# Vivado block design pfm_dynamic, xcu200-fsgd2104-2-e, Vivado 2020.2
# (continued, part 2 of 3)
current_bd_instance /slr0

# ---- hierarchy /slr0/reset_controllers ----
current_bd_instance /slr0/reset_controllers
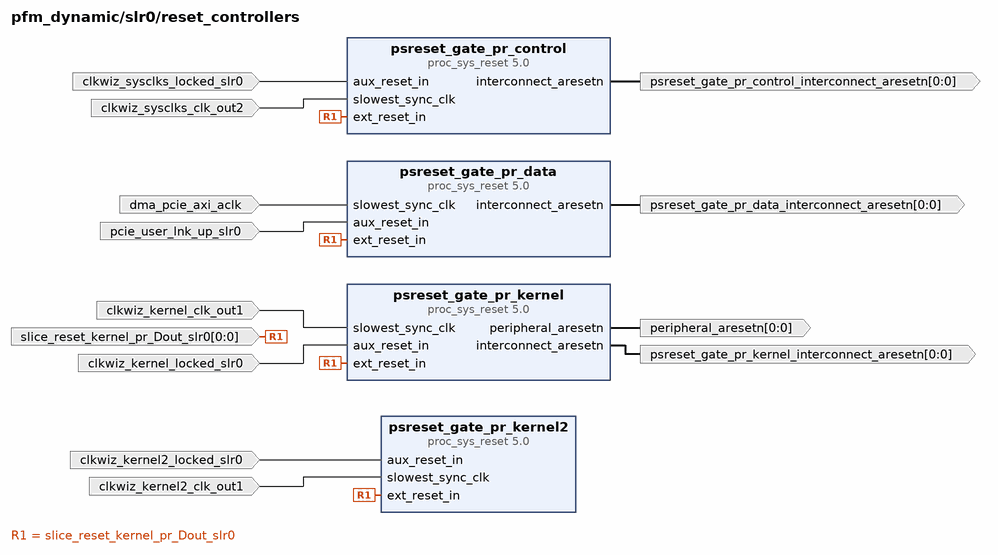
[diagram p9: block diagram inside /slr0/reset_controllers]
create_bd_pin -dir I -type clk clkwiz_kernel2_clk_out1
create_bd_pin -dir I clkwiz_kernel2_locked_slr0
create_bd_pin -dir I -type clk clkwiz_kernel_clk_out1
create_bd_pin -dir I clkwiz_kernel_locked_slr0
create_bd_pin -dir I -type clk clkwiz_sysclks_clk_out2
create_bd_pin -dir I clkwiz_sysclks_locked_slr0
create_bd_pin -dir I -type clk dma_pcie_axi_aclk
create_bd_pin -dir I pcie_user_lnk_up_slr0
create_bd_pin -dir O -from 0 -to 0 -type rst psreset_gate_pr_control_interconnect_aresetn
create_bd_pin -dir O -from 0 -to 0 -type rst psreset_gate_pr_data_interconnect_aresetn
create_bd_pin -dir O -from 0 -to 0 -type rst psreset_gate_pr_kernel_interconnect_aresetn
create_bd_pin -dir I -from 0 -to 0 -type rst slice_reset_kernel_pr_Dout_slr0
create_bd_pin -dir O -from 0 -to 0 -type rst peripheral_aresetn

create_bd_cell -type ip -vlnv xilinx.com:ip:proc_sys_reset:5.0 psreset_gate_pr_control
set_property -dict [list \
  CONFIG.C_AUX_RESET_HIGH 0 \
  CONFIG.C_AUX_RST_WIDTH 1 \
  CONFIG.C_EXT_RST_WIDTH 1 \
] [get_bd_cells psreset_gate_pr_control]
create_bd_cell -type ip -vlnv xilinx.com:ip:proc_sys_reset:5.0 psreset_gate_pr_data
set_property -dict [list \
  CONFIG.C_AUX_RESET_HIGH 0 \
  CONFIG.C_AUX_RST_WIDTH 1 \
  CONFIG.C_EXT_RST_WIDTH 1 \
] [get_bd_cells psreset_gate_pr_data]
create_bd_cell -type ip -vlnv xilinx.com:ip:proc_sys_reset:5.0 psreset_gate_pr_kernel
set_property -dict [list \
  CONFIG.C_AUX_RESET_HIGH 0 \
  CONFIG.C_AUX_RST_WIDTH 1 \
  CONFIG.C_EXT_RST_WIDTH 1 \
  CONFIG.SLR_ASSIGNMENTS SLR0 \
] [get_bd_cells psreset_gate_pr_kernel]
create_bd_cell -type ip -vlnv xilinx.com:ip:proc_sys_reset:5.0 psreset_gate_pr_kernel2
set_property -dict [list \
  CONFIG.C_AUX_RESET_HIGH 0 \
  CONFIG.C_AUX_RST_WIDTH 1 \
  CONFIG.C_EXT_RST_WIDTH 1 \
  CONFIG.SLR_ASSIGNMENTS SLR0 \
] [get_bd_cells psreset_gate_pr_kernel2]

# ---- hierarchy /slr1 ----
current_bd_instance /slr1
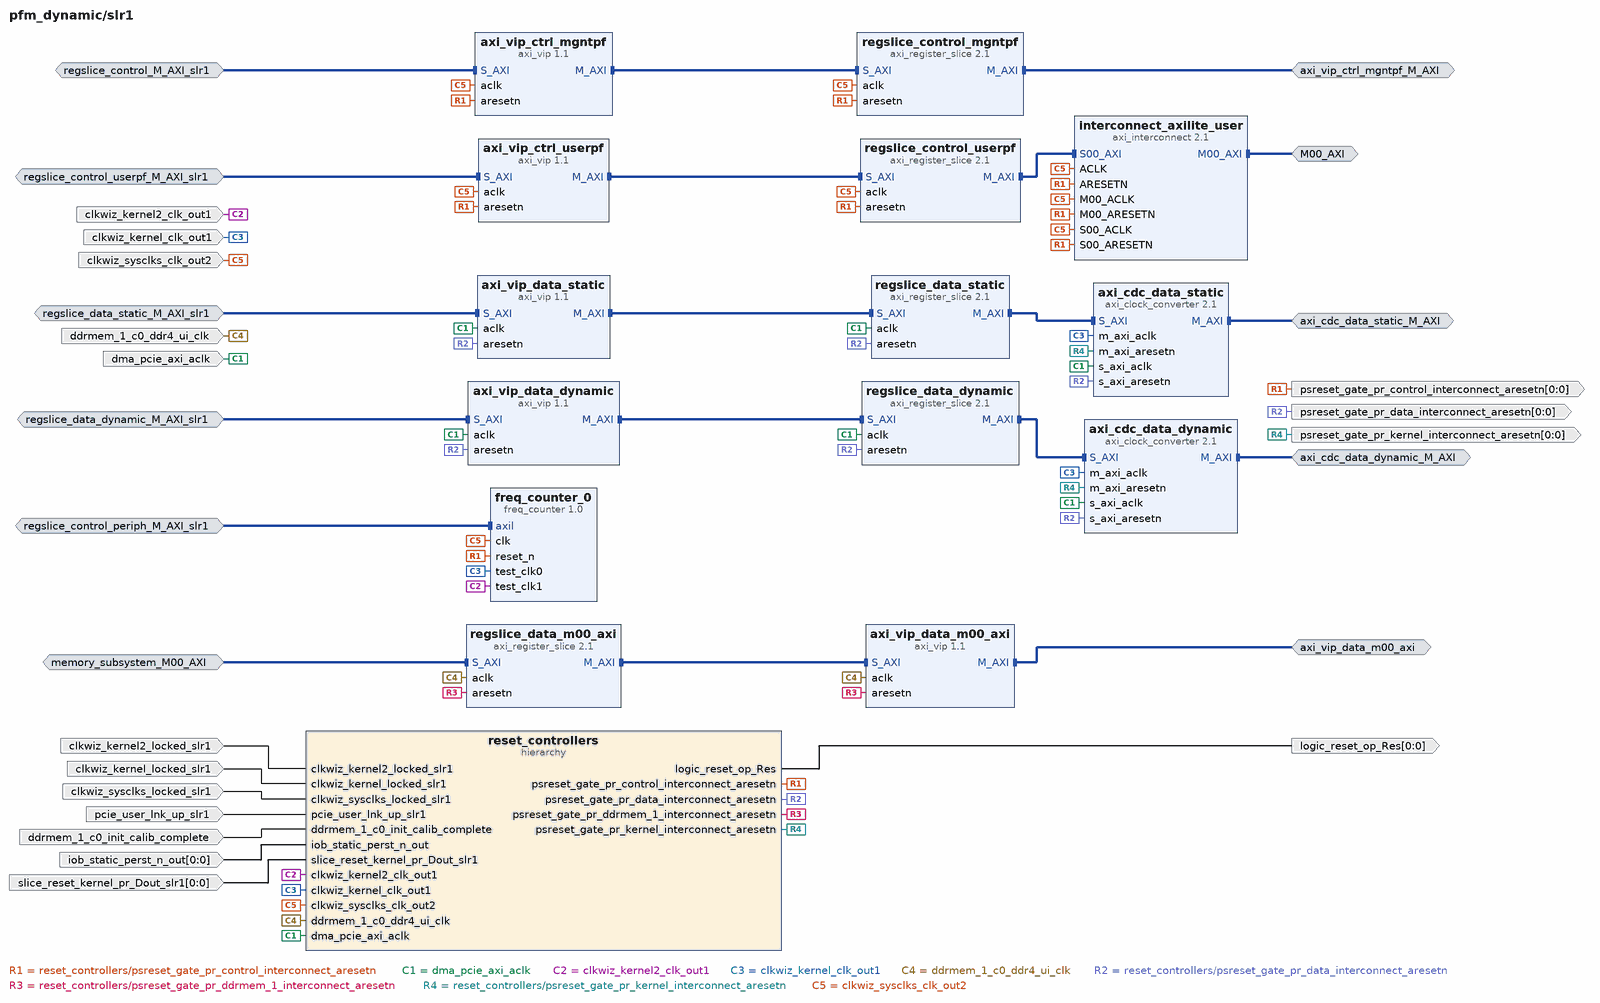
[diagram p10: block diagram inside /slr1]
create_bd_intf_pin -mode Master -vlnv xilinx.com:interface:aximm_rtl:1.0 axi_cdc_data_dynamic_M_AXI
create_bd_intf_pin -mode Master -vlnv xilinx.com:interface:aximm_rtl:1.0 axi_cdc_data_static_M_AXI
create_bd_intf_pin -mode Master -vlnv xilinx.com:interface:aximm_rtl:1.0 axi_vip_ctrl_mgntpf_M_AXI
create_bd_intf_pin -mode Master -vlnv xilinx.com:interface:aximm_rtl:1.0 axi_vip_data_m00_axi
create_bd_intf_pin -mode Slave -vlnv xilinx.com:interface:aximm_rtl:1.0 memory_subsystem_M00_AXI
create_bd_intf_pin -mode Slave -vlnv xilinx.com:interface:aximm_rtl:1.0 regslice_control_M_AXI_slr1
create_bd_intf_pin -mode Slave -vlnv xilinx.com:interface:aximm_rtl:1.0 regslice_control_periph_M_AXI_slr1
create_bd_intf_pin -mode Slave -vlnv xilinx.com:interface:aximm_rtl:1.0 regslice_control_userpf_M_AXI_slr1
create_bd_intf_pin -mode Slave -vlnv xilinx.com:interface:aximm_rtl:1.0 regslice_data_dynamic_M_AXI_slr1
create_bd_intf_pin -mode Slave -vlnv xilinx.com:interface:aximm_rtl:1.0 regslice_data_static_M_AXI_slr1
create_bd_intf_pin -mode Master -vlnv xilinx.com:interface:aximm_rtl:1.0 M00_AXI
create_bd_pin -dir I -type clk clkwiz_kernel2_clk_out1
create_bd_pin -dir I clkwiz_kernel2_locked_slr1
create_bd_pin -dir I -type clk clkwiz_kernel_clk_out1
create_bd_pin -dir I clkwiz_kernel_locked_slr1
create_bd_pin -dir I -type clk clkwiz_sysclks_clk_out2
create_bd_pin -dir I clkwiz_sysclks_locked_slr1
create_bd_pin -dir I -type clk ddrmem_1_c0_ddr4_ui_clk
create_bd_pin -dir I ddrmem_1_c0_init_calib_complete
create_bd_pin -dir I -type clk dma_pcie_axi_aclk
create_bd_pin -dir I -from 0 -to 0 iob_static_perst_n_out
create_bd_pin -dir O -from 0 -to 0 logic_reset_op_Res
create_bd_pin -dir I pcie_user_lnk_up_slr1
create_bd_pin -dir O -from 0 -to 0 -type rst psreset_gate_pr_data_interconnect_aresetn
create_bd_pin -dir O -from 0 -to 0 -type rst psreset_gate_pr_kernel_interconnect_aresetn
create_bd_pin -dir I -from 0 -to 0 -type rst slice_reset_kernel_pr_Dout_slr1
create_bd_pin -dir O -from 0 -to 0 -type rst psreset_gate_pr_control_interconnect_aresetn

create_bd_cell -type ip -vlnv xilinx.com:user:freq_counter:1.0 freq_counter_0
set_property -dict {CONFIG.REF_CLK_FREQ_HZ 50925} [get_bd_cells freq_counter_0]
create_bd_cell -type hier reset_controllers
create_bd_cell -type ip -vlnv xilinx.com:ip:axi_interconnect:2.1 interconnect_axilite_user
set_property -dict [list \
  CONFIG.M00_HAS_REGSLICE 4 \
  CONFIG.M01_HAS_REGSLICE 4 \
  CONFIG.M02_HAS_REGSLICE 4 \
  CONFIG.M03_HAS_REGSLICE 4 \
  CONFIG.M04_HAS_REGSLICE 4 \
  CONFIG.M05_HAS_REGSLICE 4 \
  CONFIG.M06_HAS_REGSLICE 4 \
  CONFIG.M07_HAS_REGSLICE 4 \
  CONFIG.M08_HAS_REGSLICE 4 \
  CONFIG.M09_HAS_REGSLICE 4 \
  CONFIG.M10_HAS_REGSLICE 4 \
  CONFIG.M11_HAS_REGSLICE 4 \
  CONFIG.M12_HAS_REGSLICE 4 \
  CONFIG.M13_HAS_REGSLICE 4 \
  CONFIG.M14_HAS_REGSLICE 4 \
  CONFIG.M15_HAS_REGSLICE 4 \
  CONFIG.M16_HAS_REGSLICE 4 \
  CONFIG.M17_HAS_REGSLICE 4 \
  CONFIG.M18_HAS_REGSLICE 4 \
  CONFIG.M19_HAS_REGSLICE 4 \
  CONFIG.M20_HAS_REGSLICE 4 \
  CONFIG.M21_HAS_REGSLICE 4 \
  CONFIG.M22_HAS_REGSLICE 4 \
  CONFIG.M23_HAS_REGSLICE 4 \
  CONFIG.M24_HAS_REGSLICE 4 \
  CONFIG.M25_HAS_REGSLICE 4 \
  CONFIG.M26_HAS_REGSLICE 4 \
  CONFIG.M27_HAS_REGSLICE 4 \
  CONFIG.M28_HAS_REGSLICE 4 \
  CONFIG.M29_HAS_REGSLICE 4 \
  CONFIG.M30_HAS_REGSLICE 4 \
  CONFIG.M31_HAS_REGSLICE 4 \
  CONFIG.M32_HAS_REGSLICE 4 \
  CONFIG.M33_HAS_REGSLICE 4 \
  CONFIG.M34_HAS_REGSLICE 4 \
  CONFIG.M35_HAS_REGSLICE 4 \
  CONFIG.M36_HAS_REGSLICE 4 \
  CONFIG.M37_HAS_REGSLICE 4 \
  CONFIG.M38_HAS_REGSLICE 4 \
  CONFIG.M39_HAS_REGSLICE 4 \
  CONFIG.M40_HAS_REGSLICE 4 \
  CONFIG.M41_HAS_REGSLICE 4 \
  CONFIG.M42_HAS_REGSLICE 4 \
  CONFIG.M43_HAS_REGSLICE 4 \
  CONFIG.M44_HAS_REGSLICE 4 \
  CONFIG.M45_HAS_REGSLICE 4 \
  CONFIG.M46_HAS_REGSLICE 4 \
  CONFIG.M47_HAS_REGSLICE 4 \
  CONFIG.M48_HAS_REGSLICE 4 \
  CONFIG.M49_HAS_REGSLICE 4 \
  CONFIG.M50_HAS_REGSLICE 4 \
  CONFIG.M51_HAS_REGSLICE 4 \
  CONFIG.M52_HAS_REGSLICE 4 \
  CONFIG.M53_HAS_REGSLICE 4 \
  CONFIG.M54_HAS_REGSLICE 4 \
  CONFIG.M55_HAS_REGSLICE 4 \
  CONFIG.M56_HAS_REGSLICE 4 \
  CONFIG.M57_HAS_REGSLICE 4 \
  CONFIG.M58_HAS_REGSLICE 4 \
  CONFIG.M59_HAS_REGSLICE 4 \
  CONFIG.M60_HAS_REGSLICE 4 \
  CONFIG.M61_HAS_REGSLICE 4 \
  CONFIG.M62_HAS_REGSLICE 4 \
  CONFIG.M63_HAS_REGSLICE 4 \
  CONFIG.NUM_MI 1 \
  CONFIG.NUM_SI 1 \
  CONFIG.S00_HAS_REGSLICE 4 \
  CONFIG.SLR_ASSIGNMENTS SLR1 \
] [get_bd_cells interconnect_axilite_user]
create_bd_cell -type ip -vlnv xilinx.com:ip:axi_clock_converter:2.1 axi_cdc_data_dynamic
set_property -dict {CONFIG.SLR_ASSIGNMENTS SLR1} [get_bd_cells axi_cdc_data_dynamic]
create_bd_cell -type ip -vlnv xilinx.com:ip:axi_clock_converter:2.1 axi_cdc_data_static
set_property -dict {CONFIG.SLR_ASSIGNMENTS SLR1} [get_bd_cells axi_cdc_data_static]
create_bd_cell -type ip -vlnv xilinx.com:ip:axi_vip:1.1 axi_vip_ctrl_mgntpf
create_bd_cell -type ip -vlnv xilinx.com:ip:axi_vip:1.1 axi_vip_ctrl_userpf
create_bd_cell -type ip -vlnv xilinx.com:ip:axi_vip:1.1 axi_vip_data_dynamic
create_bd_cell -type ip -vlnv xilinx.com:ip:axi_vip:1.1 axi_vip_data_m00_axi
create_bd_cell -type ip -vlnv xilinx.com:ip:axi_vip:1.1 axi_vip_data_static
create_bd_cell -type ip -vlnv xilinx.com:ip:axi_register_slice:2.1 regslice_control_mgntpf
set_property -dict [list \
  CONFIG.ADDR_WIDTH 26 \
  CONFIG.DATA_WIDTH 32 \
  CONFIG.PROTOCOL AXI4LITE \
  CONFIG.READ_WRITE_MODE READ_WRITE \
  CONFIG.REG_R 7 \
  CONFIG.REG_W 7 \
  CONFIG.SLR_ASSIGNMENTS SLR1 \
] [get_bd_cells regslice_control_mgntpf]
create_bd_cell -type ip -vlnv xilinx.com:ip:axi_register_slice:2.1 regslice_control_userpf
set_property -dict [list \
  CONFIG.ADDR_WIDTH 25 \
  CONFIG.DATA_WIDTH 32 \
  CONFIG.PROTOCOL AXI4LITE \
  CONFIG.READ_WRITE_MODE READ_WRITE \
  CONFIG.REG_R 7 \
  CONFIG.REG_W 7 \
  CONFIG.SLR_ASSIGNMENTS SLR1 \
] [get_bd_cells regslice_control_userpf]
create_bd_cell -type ip -vlnv xilinx.com:ip:axi_register_slice:2.1 regslice_data_dynamic
set_property -dict [list \
  CONFIG.ADDR_WIDTH 39 \
  CONFIG.DATA_WIDTH 512 \
  CONFIG.ID_WIDTH 4 \
  CONFIG.PROTOCOL AXI4 \
  CONFIG.READ_WRITE_MODE READ_WRITE \
  CONFIG.REG_AR 1 \
  CONFIG.REG_AW 1 \
  CONFIG.REG_B 1 \
  CONFIG.SLR_ASSIGNMENTS SLR1 \
] [get_bd_cells regslice_data_dynamic]
create_bd_cell -type ip -vlnv xilinx.com:ip:axi_register_slice:2.1 regslice_data_m00_axi
set_property -dict [list \
  CONFIG.REG_AR 1 \
  CONFIG.REG_AW 1 \
  CONFIG.REG_B 1 \
  CONFIG.SLR_ASSIGNMENTS SLR1 \
] [get_bd_cells regslice_data_m00_axi]
create_bd_cell -type ip -vlnv xilinx.com:ip:axi_register_slice:2.1 regslice_data_static
set_property -dict [list \
  CONFIG.ADDR_WIDTH 39 \
  CONFIG.DATA_WIDTH 512 \
  CONFIG.ID_WIDTH 4 \
  CONFIG.PROTOCOL AXI4 \
  CONFIG.READ_WRITE_MODE READ_WRITE \
  CONFIG.REG_AR 1 \
  CONFIG.REG_AW 1 \
  CONFIG.REG_B 1 \
  CONFIG.REG_W 1 \
  CONFIG.SLR_ASSIGNMENTS SLR1 \
] [get_bd_cells regslice_data_static]

# ---- hierarchy /slr1/reset_controllers ----
current_bd_instance /slr1/reset_controllers
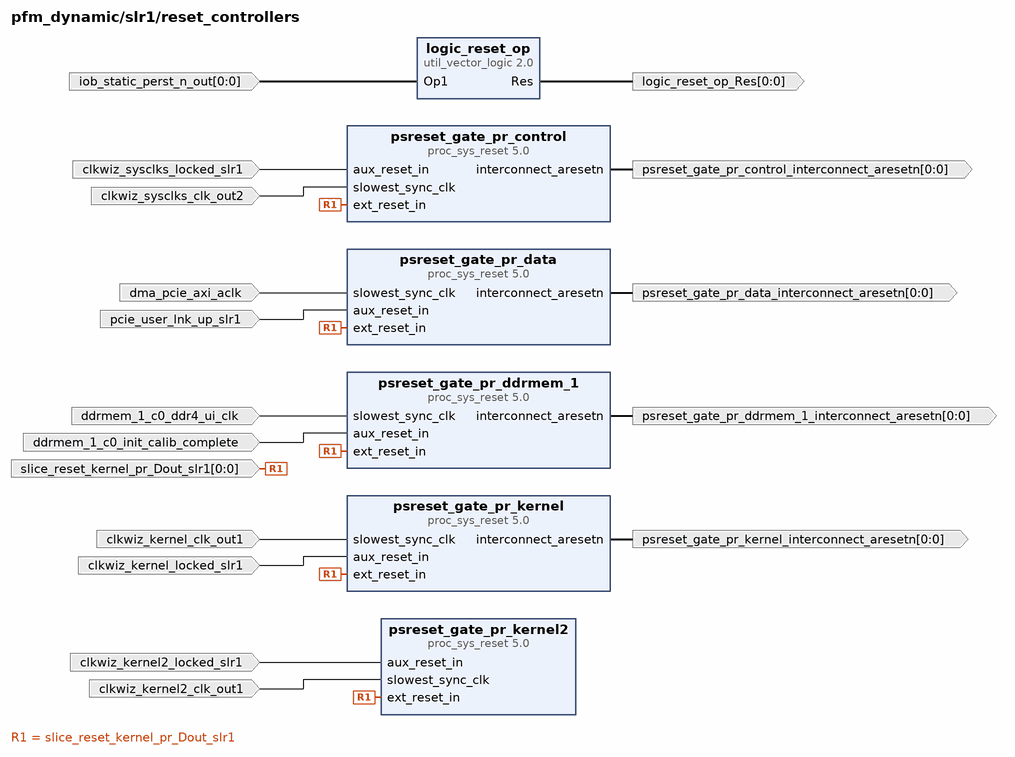
[diagram p11: block diagram inside /slr1/reset_controllers]
create_bd_pin -dir I -type clk clkwiz_kernel2_clk_out1
create_bd_pin -dir I clkwiz_kernel2_locked_slr1
create_bd_pin -dir I -type clk clkwiz_kernel_clk_out1
create_bd_pin -dir I clkwiz_kernel_locked_slr1
create_bd_pin -dir I -type clk clkwiz_sysclks_clk_out2
create_bd_pin -dir I clkwiz_sysclks_locked_slr1
create_bd_pin -dir I -type clk ddrmem_1_c0_ddr4_ui_clk
create_bd_pin -dir I ddrmem_1_c0_init_calib_complete
create_bd_pin -dir I -type clk dma_pcie_axi_aclk
create_bd_pin -dir I -from 0 -to 0 iob_static_perst_n_out
create_bd_pin -dir O -from 0 -to 0 logic_reset_op_Res
create_bd_pin -dir I pcie_user_lnk_up_slr1
create_bd_pin -dir O -from 0 -to 0 -type rst psreset_gate_pr_control_interconnect_aresetn
create_bd_pin -dir O -from 0 -to 0 -type rst psreset_gate_pr_data_interconnect_aresetn
create_bd_pin -dir O -from 0 -to 0 -type rst psreset_gate_pr_ddrmem_1_interconnect_aresetn
create_bd_pin -dir O -from 0 -to 0 -type rst psreset_gate_pr_kernel_interconnect_aresetn
create_bd_pin -dir I -from 0 -to 0 -type rst slice_reset_kernel_pr_Dout_slr1

create_bd_cell -type ip -vlnv xilinx.com:ip:proc_sys_reset:5.0 psreset_gate_pr_control
set_property -dict [list \
  CONFIG.C_AUX_RESET_HIGH 0 \
  CONFIG.C_AUX_RST_WIDTH 1 \
  CONFIG.C_EXT_RST_WIDTH 1 \
] [get_bd_cells psreset_gate_pr_control]
create_bd_cell -type ip -vlnv xilinx.com:ip:proc_sys_reset:5.0 psreset_gate_pr_data
set_property -dict [list \
  CONFIG.C_AUX_RESET_HIGH 0 \
  CONFIG.C_AUX_RST_WIDTH 1 \
  CONFIG.C_EXT_RST_WIDTH 1 \
] [get_bd_cells psreset_gate_pr_data]
create_bd_cell -type ip -vlnv xilinx.com:ip:proc_sys_reset:5.0 psreset_gate_pr_ddrmem_1
set_property -dict [list \
  CONFIG.C_AUX_RESET_HIGH 0 \
  CONFIG.C_AUX_RST_WIDTH 1 \
  CONFIG.C_EXT_RST_WIDTH 1 \
] [get_bd_cells psreset_gate_pr_ddrmem_1]
create_bd_cell -type ip -vlnv xilinx.com:ip:proc_sys_reset:5.0 psreset_gate_pr_kernel
set_property -dict [list \
  CONFIG.C_AUX_RESET_HIGH 0 \
  CONFIG.C_AUX_RST_WIDTH 1 \
  CONFIG.C_EXT_RST_WIDTH 1 \
  CONFIG.SLR_ASSIGNMENTS SLR1 \
] [get_bd_cells psreset_gate_pr_kernel]
create_bd_cell -type ip -vlnv xilinx.com:ip:proc_sys_reset:5.0 psreset_gate_pr_kernel2
set_property -dict [list \
  CONFIG.C_AUX_RESET_HIGH 0 \
  CONFIG.C_AUX_RST_WIDTH 1 \
  CONFIG.C_EXT_RST_WIDTH 1 \
  CONFIG.SLR_ASSIGNMENTS SLR1 \
] [get_bd_cells psreset_gate_pr_kernel2]
create_bd_cell -type ip -vlnv xilinx.com:ip:util_vector_logic:2.0 logic_reset_op
set_property -dict {CONFIG.C_OPERATION not CONFIG.C_SIZE 1} [get_bd_cells logic_reset_op]

# ---- hierarchy /slr2 ----
current_bd_instance /slr2
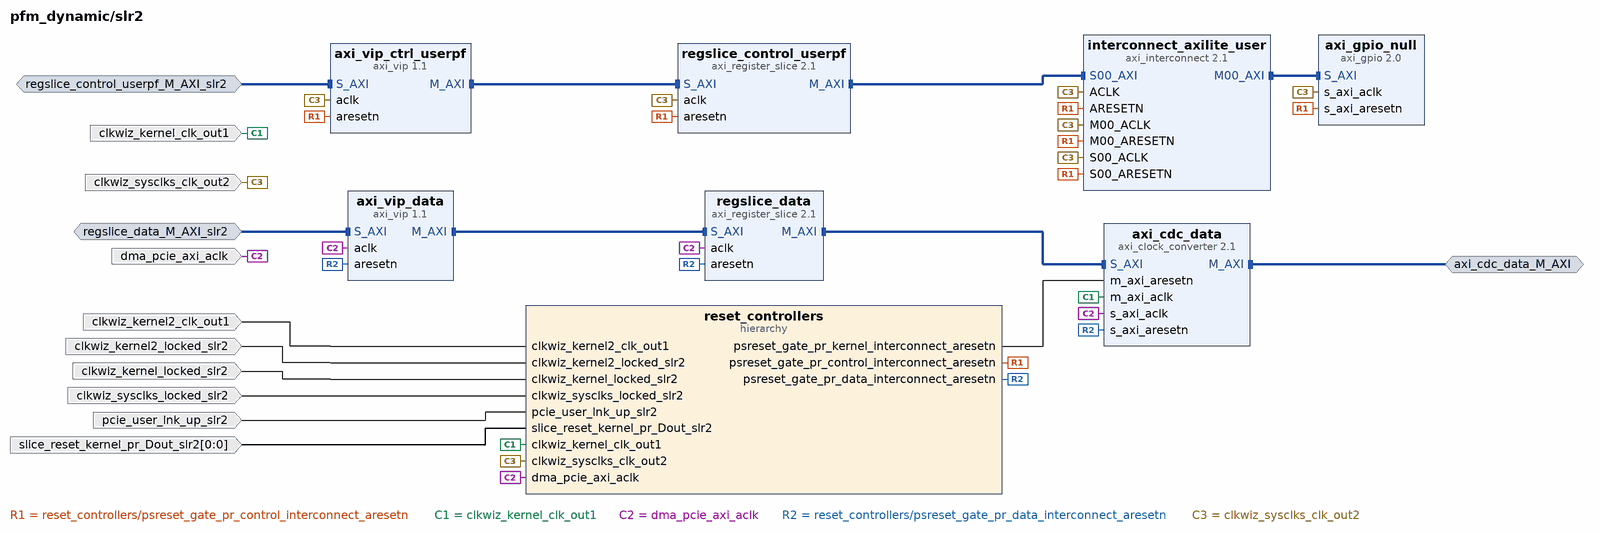
[diagram p12: block diagram inside /slr2]
create_bd_intf_pin -mode Master -vlnv xilinx.com:interface:aximm_rtl:1.0 axi_cdc_data_M_AXI
create_bd_intf_pin -mode Slave -vlnv xilinx.com:interface:aximm_rtl:1.0 regslice_control_userpf_M_AXI_slr2
create_bd_intf_pin -mode Slave -vlnv xilinx.com:interface:aximm_rtl:1.0 regslice_data_M_AXI_slr2
create_bd_pin -dir I -type clk clkwiz_kernel2_clk_out1
create_bd_pin -dir I clkwiz_kernel2_locked_slr2
create_bd_pin -dir I -type clk clkwiz_kernel_clk_out1
create_bd_pin -dir I clkwiz_kernel_locked_slr2
create_bd_pin -dir I -type clk clkwiz_sysclks_clk_out2
create_bd_pin -dir I clkwiz_sysclks_locked_slr2
create_bd_pin -dir I -type clk dma_pcie_axi_aclk
create_bd_pin -dir I pcie_user_lnk_up_slr2
create_bd_pin -dir I -from 0 -to 0 -type rst slice_reset_kernel_pr_Dout_slr2

create_bd_cell -type hier reset_controllers
create_bd_cell -type ip -vlnv xilinx.com:ip:axi_interconnect:2.1 interconnect_axilite_user
set_property -dict [list \
  CONFIG.M00_HAS_REGSLICE 4 \
  CONFIG.M01_HAS_REGSLICE 4 \
  CONFIG.M02_HAS_REGSLICE 4 \
  CONFIG.M03_HAS_REGSLICE 4 \
  CONFIG.M04_HAS_REGSLICE 4 \
  CONFIG.M05_HAS_REGSLICE 4 \
  CONFIG.M06_HAS_REGSLICE 4 \
  CONFIG.M07_HAS_REGSLICE 4 \
  CONFIG.M08_HAS_REGSLICE 4 \
  CONFIG.M09_HAS_REGSLICE 4 \
  CONFIG.M10_HAS_REGSLICE 4 \
  CONFIG.M11_HAS_REGSLICE 4 \
  CONFIG.M12_HAS_REGSLICE 4 \
  CONFIG.M13_HAS_REGSLICE 4 \
  CONFIG.M14_HAS_REGSLICE 4 \
  CONFIG.M15_HAS_REGSLICE 4 \
  CONFIG.M16_HAS_REGSLICE 4 \
  CONFIG.M17_HAS_REGSLICE 4 \
  CONFIG.M18_HAS_REGSLICE 4 \
  CONFIG.M19_HAS_REGSLICE 4 \
  CONFIG.M20_HAS_REGSLICE 4 \
  CONFIG.M21_HAS_REGSLICE 4 \
  CONFIG.M22_HAS_REGSLICE 4 \
  CONFIG.M23_HAS_REGSLICE 4 \
  CONFIG.M24_HAS_REGSLICE 4 \
  CONFIG.M25_HAS_REGSLICE 4 \
  CONFIG.M26_HAS_REGSLICE 4 \
  CONFIG.M27_HAS_REGSLICE 4 \
  CONFIG.M28_HAS_REGSLICE 4 \
  CONFIG.M29_HAS_REGSLICE 4 \
  CONFIG.M30_HAS_REGSLICE 4 \
  CONFIG.M31_HAS_REGSLICE 4 \
  CONFIG.M32_HAS_REGSLICE 4 \
  CONFIG.M33_HAS_REGSLICE 4 \
  CONFIG.M34_HAS_REGSLICE 4 \
  CONFIG.M35_HAS_REGSLICE 4 \
  CONFIG.M36_HAS_REGSLICE 4 \
  CONFIG.M37_HAS_REGSLICE 4 \
  CONFIG.M38_HAS_REGSLICE 4 \
  CONFIG.M39_HAS_REGSLICE 4 \
  CONFIG.M40_HAS_REGSLICE 4 \
  CONFIG.M41_HAS_REGSLICE 4 \
  CONFIG.M42_HAS_REGSLICE 4 \
  CONFIG.M43_HAS_REGSLICE 4 \
  CONFIG.M44_HAS_REGSLICE 4 \
  CONFIG.M45_HAS_REGSLICE 4 \
  CONFIG.M46_HAS_REGSLICE 4 \
  CONFIG.M47_HAS_REGSLICE 4 \
  CONFIG.M48_HAS_REGSLICE 4 \
  CONFIG.M49_HAS_REGSLICE 4 \
  CONFIG.M50_HAS_REGSLICE 4 \
  CONFIG.M51_HAS_REGSLICE 4 \
  CONFIG.M52_HAS_REGSLICE 4 \
  CONFIG.M53_HAS_REGSLICE 4 \
  CONFIG.M54_HAS_REGSLICE 4 \
  CONFIG.M55_HAS_REGSLICE 4 \
  CONFIG.M56_HAS_REGSLICE 4 \
  CONFIG.M57_HAS_REGSLICE 4 \
  CONFIG.M58_HAS_REGSLICE 4 \
  CONFIG.M59_HAS_REGSLICE 4 \
  CONFIG.M60_HAS_REGSLICE 4 \
  CONFIG.M61_HAS_REGSLICE 4 \
  CONFIG.M62_HAS_REGSLICE 4 \
  CONFIG.M63_HAS_REGSLICE 4 \
  CONFIG.NUM_MI 1 \
  CONFIG.NUM_SI 1 \
  CONFIG.S00_HAS_REGSLICE 4 \
  CONFIG.SLR_ASSIGNMENTS SLR2 \
] [get_bd_cells interconnect_axilite_user]
create_bd_cell -type ip -vlnv xilinx.com:ip:axi_clock_converter:2.1 axi_cdc_data
set_property -dict {CONFIG.SLR_ASSIGNMENTS SLR2} [get_bd_cells axi_cdc_data]
create_bd_cell -type ip -vlnv xilinx.com:ip:axi_gpio:2.0 axi_gpio_null
create_bd_cell -type ip -vlnv xilinx.com:ip:axi_vip:1.1 axi_vip_ctrl_userpf
create_bd_cell -type ip -vlnv xilinx.com:ip:axi_vip:1.1 axi_vip_data
create_bd_cell -type ip -vlnv xilinx.com:ip:axi_register_slice:2.1 regslice_control_userpf
set_property -dict [list \
  CONFIG.ADDR_WIDTH 25 \
  CONFIG.DATA_WIDTH 32 \
  CONFIG.PROTOCOL AXI4LITE \
  CONFIG.READ_WRITE_MODE READ_WRITE \
  CONFIG.REG_R 7 \
  CONFIG.REG_W 7 \
  CONFIG.SLR_ASSIGNMENTS SLR2 \
] [get_bd_cells regslice_control_userpf]
create_bd_cell -type ip -vlnv xilinx.com:ip:axi_register_slice:2.1 regslice_data
set_property -dict [list \
  CONFIG.ADDR_WIDTH 39 \
  CONFIG.DATA_WIDTH 512 \
  CONFIG.ID_WIDTH 4 \
  CONFIG.PROTOCOL AXI4 \
  CONFIG.READ_WRITE_MODE READ_WRITE \
  CONFIG.REG_AR 1 \
  CONFIG.REG_AW 1 \
  CONFIG.REG_B 1 \
  CONFIG.REG_W 1 \
  CONFIG.SLR_ASSIGNMENTS SLR2 \
] [get_bd_cells regslice_data]

# ---- hierarchy /slr2/reset_controllers ----
current_bd_instance /slr2/reset_controllers
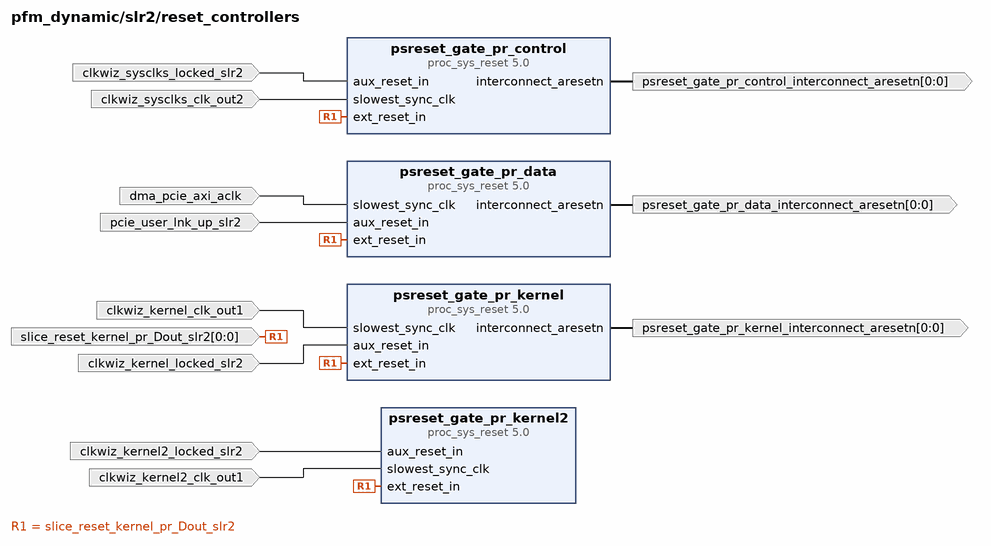
[diagram p13: block diagram inside /slr2/reset_controllers]
create_bd_pin -dir I -type clk clkwiz_kernel2_clk_out1
create_bd_pin -dir I clkwiz_kernel2_locked_slr2
create_bd_pin -dir I -type clk clkwiz_kernel_clk_out1
create_bd_pin -dir I clkwiz_kernel_locked_slr2
create_bd_pin -dir I -type clk clkwiz_sysclks_clk_out2
create_bd_pin -dir I clkwiz_sysclks_locked_slr2
create_bd_pin -dir I -type clk dma_pcie_axi_aclk
create_bd_pin -dir I pcie_user_lnk_up_slr2
create_bd_pin -dir O -from 0 -to 0 -type rst psreset_gate_pr_control_interconnect_aresetn
create_bd_pin -dir O -from 0 -to 0 -type rst psreset_gate_pr_data_interconnect_aresetn
create_bd_pin -dir O -from 0 -to 0 -type rst psreset_gate_pr_kernel_interconnect_aresetn
create_bd_pin -dir I -from 0 -to 0 -type rst slice_reset_kernel_pr_Dout_slr2

create_bd_cell -type ip -vlnv xilinx.com:ip:proc_sys_reset:5.0 psreset_gate_pr_control
set_property -dict [list \
  CONFIG.C_AUX_RESET_HIGH 0 \
  CONFIG.C_AUX_RST_WIDTH 1 \
  CONFIG.C_EXT_RST_WIDTH 1 \
] [get_bd_cells psreset_gate_pr_control]
create_bd_cell -type ip -vlnv xilinx.com:ip:proc_sys_reset:5.0 psreset_gate_pr_data
set_property -dict [list \
  CONFIG.C_AUX_RESET_HIGH 0 \
  CONFIG.C_AUX_RST_WIDTH 1 \
  CONFIG.C_EXT_RST_WIDTH 1 \
] [get_bd_cells psreset_gate_pr_data]
create_bd_cell -type ip -vlnv xilinx.com:ip:proc_sys_reset:5.0 psreset_gate_pr_kernel
set_property -dict [list \
  CONFIG.C_AUX_RESET_HIGH 0 \
  CONFIG.C_AUX_RST_WIDTH 1 \
  CONFIG.C_EXT_RST_WIDTH 1 \
  CONFIG.SLR_ASSIGNMENTS SLR2 \
] [get_bd_cells psreset_gate_pr_kernel]
create_bd_cell -type ip -vlnv xilinx.com:ip:proc_sys_reset:5.0 psreset_gate_pr_kernel2
set_property -dict [list \
  CONFIG.C_AUX_RESET_HIGH 0 \
  CONFIG.C_AUX_RST_WIDTH 1 \
  CONFIG.C_EXT_RST_WIDTH 1 \
  CONFIG.SLR_ASSIGNMENTS SLR2 \
] [get_bd_cells psreset_gate_pr_kernel2]

# ---- hierarchy /System_DPA ----
current_bd_instance /System_DPA
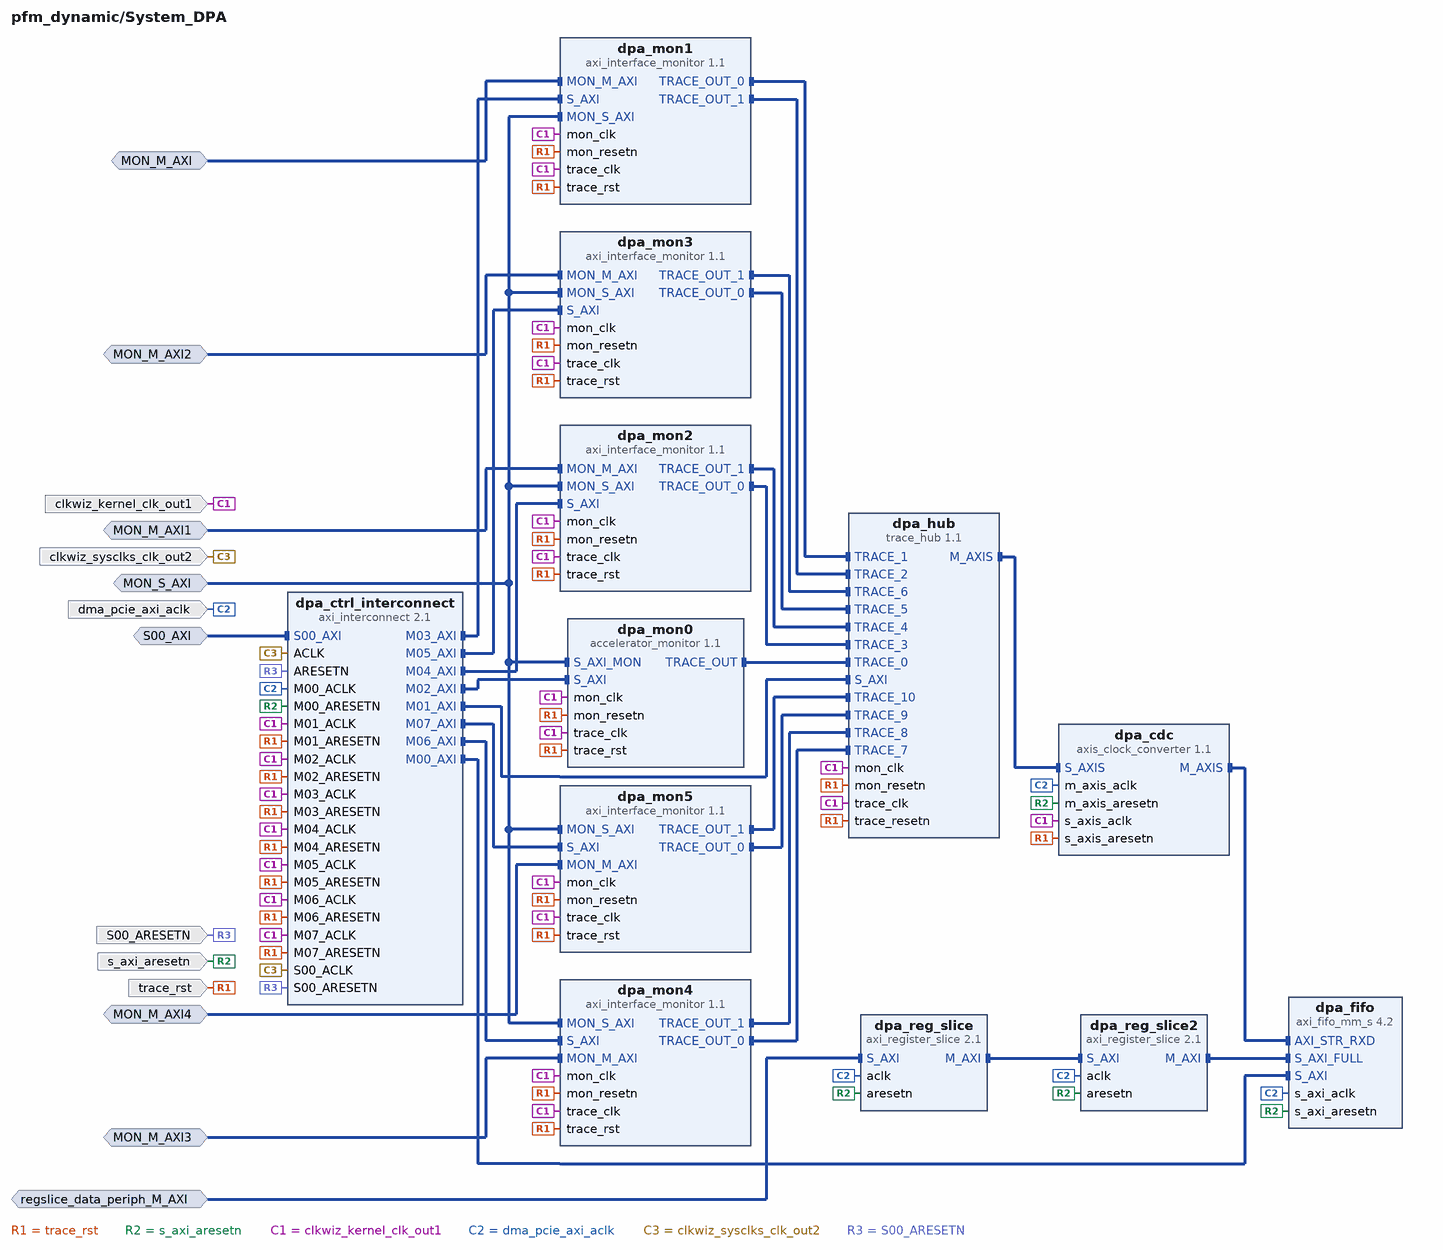
[diagram p14: block diagram inside /System_DPA]
create_bd_intf_pin -mode Slave -vlnv xilinx.com:interface:aximm_rtl:1.0 S00_AXI
create_bd_intf_pin -mode Monitor -vlnv xilinx.com:interface:aximm_rtl:1.0 MON_S_AXI
create_bd_intf_pin -mode Monitor -vlnv xilinx.com:interface:aximm_rtl:1.0 MON_M_AXI
create_bd_intf_pin -mode Monitor -vlnv xilinx.com:interface:aximm_rtl:1.0 MON_M_AXI1
create_bd_intf_pin -mode Monitor -vlnv xilinx.com:interface:aximm_rtl:1.0 MON_M_AXI2
create_bd_intf_pin -mode Monitor -vlnv xilinx.com:interface:aximm_rtl:1.0 MON_M_AXI3
create_bd_intf_pin -mode Monitor -vlnv xilinx.com:interface:aximm_rtl:1.0 MON_M_AXI4
create_bd_intf_pin -mode Slave -vlnv xilinx.com:interface:aximm_rtl:1.0 regslice_data_periph_M_AXI
create_bd_pin -dir I -type rst trace_rst
create_bd_pin -dir I -type rst s_axi_aresetn
create_bd_pin -dir I -type clk clkwiz_kernel_clk_out1
create_bd_pin -dir I -type clk dma_pcie_axi_aclk
create_bd_pin -dir I -type clk clkwiz_sysclks_clk_out2
create_bd_pin -dir I -type rst S00_ARESETN

create_bd_cell -type ip -vlnv xilinx.com:ip:axis_clock_converter:1.1 dpa_cdc
create_bd_cell -type ip -vlnv xilinx.com:ip:axi_interconnect:2.1 dpa_ctrl_interconnect
set_property -dict [list \
  CONFIG.M00_HAS_REGSLICE 1 \
  CONFIG.M01_HAS_REGSLICE 1 \
  CONFIG.M02_HAS_REGSLICE 1 \
  CONFIG.M03_HAS_REGSLICE 1 \
  CONFIG.M04_HAS_REGSLICE 1 \
  CONFIG.M05_HAS_REGSLICE 1 \
  CONFIG.M06_HAS_REGSLICE 1 \
  CONFIG.M07_HAS_REGSLICE 1 \
  CONFIG.NUM_MI 8 \
  CONFIG.NUM_SI 1 \
  CONFIG.S00_HAS_REGSLICE 1 \
] [get_bd_cells dpa_ctrl_interconnect]
create_bd_cell -type ip -vlnv xilinx.com:ip:axi_fifo_mm_s:4.2 dpa_fifo
set_property -dict [list \
  CONFIG.C_AXI4_BASEADDR 0x00000000 \
  CONFIG.C_AXI4_HIGHADDR 0x00001FFF \
  CONFIG.C_DATA_INTERFACE_TYPE 1 \
  CONFIG.C_RX_CASCADE_HEIGHT 1 \
  CONFIG.C_RX_FIFO_DEPTH 8192 \
  CONFIG.C_S_AXI4_DATA_WIDTH 64 \
  CONFIG.C_USE_RX_CUT_THROUGH true \
  CONFIG.C_USE_TX_DATA 0 \
  CONFIG.SLR_ASSIGNMENTS SLR1 \
] [get_bd_cells dpa_fifo]
create_bd_cell -type ip -vlnv xilinx.com:ip:trace_hub:1.1 dpa_hub
set_property -dict {CONFIG.NUM_TRACE_PORTS 11 CONFIG.SLR_ASSIGNMENTS SLR1} [get_bd_cells dpa_hub]
create_bd_cell -type ip -vlnv xilinx.com:ip:accelerator_monitor:1.1 dpa_mon0
set_property -dict [list \
  CONFIG.COUNT_WIDTH 64 \
  CONFIG.ENABLE_TRACE 1 \
  CONFIG.EN_AXI_LITE 1 \
  CONFIG.MONITOR_MODE 1 \
  CONFIG.STALL_MON 0 \
  CONFIG.TRACE_ID 64 \
] [get_bd_cells dpa_mon0]
create_bd_cell -type ip -vlnv xilinx.com:ip:axi_interface_monitor:1.1 dpa_mon1
set_property -dict [list \
  CONFIG.CAPTURE_BURSTS 0 \
  CONFIG.COUNT_WIDTH 64 \
  CONFIG.ENABLE_COUNTERS 1 \
  CONFIG.ENABLE_DEBUG 1 \
  CONFIG.ENABLE_TRACE 1 \
  CONFIG.EN_AXI_LITE 1 \
  CONFIG.MODE_SDACCEL 1 \
  CONFIG.TRACE_READ_ID 0 \
  CONFIG.TRACE_WRITE_ID 1 \
] [get_bd_cells dpa_mon1]
create_bd_cell -type ip -vlnv xilinx.com:ip:axi_interface_monitor:1.1 dpa_mon2
set_property -dict [list \
  CONFIG.CAPTURE_BURSTS 0 \
  CONFIG.COUNT_WIDTH 64 \
  CONFIG.ENABLE_COUNTERS 1 \
  CONFIG.ENABLE_DEBUG 1 \
  CONFIG.ENABLE_TRACE 1 \
  CONFIG.EN_AXI_LITE 1 \
  CONFIG.MODE_SDACCEL 1 \
  CONFIG.TRACE_READ_ID 2 \
  CONFIG.TRACE_WRITE_ID 3 \
] [get_bd_cells dpa_mon2]
create_bd_cell -type ip -vlnv xilinx.com:ip:axi_interface_monitor:1.1 dpa_mon3
set_property -dict [list \
  CONFIG.CAPTURE_BURSTS 0 \
  CONFIG.COUNT_WIDTH 64 \
  CONFIG.ENABLE_COUNTERS 1 \
  CONFIG.ENABLE_DEBUG 1 \
  CONFIG.ENABLE_TRACE 1 \
  CONFIG.EN_AXI_LITE 1 \
  CONFIG.MODE_SDACCEL 1 \
  CONFIG.TRACE_READ_ID 4 \
  CONFIG.TRACE_WRITE_ID 5 \
] [get_bd_cells dpa_mon3]
create_bd_cell -type ip -vlnv xilinx.com:ip:axi_interface_monitor:1.1 dpa_mon4
set_property -dict [list \
  CONFIG.CAPTURE_BURSTS 0 \
  CONFIG.COUNT_WIDTH 64 \
  CONFIG.ENABLE_COUNTERS 1 \
  CONFIG.ENABLE_DEBUG 1 \
  CONFIG.ENABLE_TRACE 1 \
  CONFIG.EN_AXI_LITE 1 \
  CONFIG.MODE_SDACCEL 1 \
  CONFIG.TRACE_READ_ID 6 \
  CONFIG.TRACE_WRITE_ID 7 \
] [get_bd_cells dpa_mon4]
create_bd_cell -type ip -vlnv xilinx.com:ip:axi_interface_monitor:1.1 dpa_mon5
set_property -dict [list \
  CONFIG.CAPTURE_BURSTS 0 \
  CONFIG.COUNT_WIDTH 64 \
  CONFIG.ENABLE_COUNTERS 1 \
  CONFIG.ENABLE_DEBUG 1 \
  CONFIG.ENABLE_TRACE 1 \
  CONFIG.EN_AXI_LITE 1 \
  CONFIG.MODE_SDACCEL 1 \
  CONFIG.TRACE_READ_ID 8 \
  CONFIG.TRACE_WRITE_ID 9 \
] [get_bd_cells dpa_mon5]
create_bd_cell -type ip -vlnv xilinx.com:ip:axi_register_slice:2.1 dpa_reg_slice
create_bd_cell -type ip -vlnv xilinx.com:ip:axi_register_slice:2.1 dpa_reg_slice2

# ---- connections ----

current_bd_instance /interrupt_concat
connect_bd_net [get_bd_pins xlconcat_interrupt_0/dout] [get_bd_pins xlconcat_interrupt/In0]
connect_bd_net [get_bd_pins xlconcat_interrupt_1/dout] [get_bd_pins xlconcat_interrupt/In1]
connect_bd_net [get_bd_pins xlconcat_interrupt_2/dout] [get_bd_pins xlconcat_interrupt/In2]
connect_bd_net [get_bd_pins xlconcat_interrupt_3/dout] [get_bd_pins xlconcat_interrupt/In3]
connect_bd_net [get_bd_pins xlconcat_interrupt/dout] [get_bd_pins xlconcat_interrupt_dout]
connect_bd_net [get_bd_pins xlconstant_gnd/dout] \
  [get_bd_pins xlconcat_interrupt_0/In1] [get_bd_pins xlconcat_interrupt_0/In2] [get_bd_pins xlconcat_interrupt_0/In3] \
  [get_bd_pins xlconcat_interrupt_0/In4] [get_bd_pins xlconcat_interrupt_0/In5] [get_bd_pins xlconcat_interrupt_0/In6] \
  [get_bd_pins xlconcat_interrupt_0/In7] [get_bd_pins xlconcat_interrupt_0/In8] [get_bd_pins xlconcat_interrupt_0/In9] \
  [get_bd_pins xlconcat_interrupt_0/In10] [get_bd_pins xlconcat_interrupt_0/In11] [get_bd_pins xlconcat_interrupt_0/In12] \
  [get_bd_pins xlconcat_interrupt_0/In13] [get_bd_pins xlconcat_interrupt_0/In14] [get_bd_pins xlconcat_interrupt_0/In15] \
  [get_bd_pins xlconcat_interrupt_0/In16] [get_bd_pins xlconcat_interrupt_0/In17] [get_bd_pins xlconcat_interrupt_0/In18] \
  [get_bd_pins xlconcat_interrupt_0/In19] [get_bd_pins xlconcat_interrupt_0/In20] [get_bd_pins xlconcat_interrupt_0/In21] \
  [get_bd_pins xlconcat_interrupt_0/In22] [get_bd_pins xlconcat_interrupt_0/In23] [get_bd_pins xlconcat_interrupt_0/In24] \
  [get_bd_pins xlconcat_interrupt_0/In25] [get_bd_pins xlconcat_interrupt_0/In26] [get_bd_pins xlconcat_interrupt_0/In27] \
  [get_bd_pins xlconcat_interrupt_0/In28] [get_bd_pins xlconcat_interrupt_0/In29] [get_bd_pins xlconcat_interrupt_0/In30] \
  [get_bd_pins xlconcat_interrupt_0/In31] [get_bd_pins xlconcat_interrupt_1/In0] [get_bd_pins xlconcat_interrupt_1/In1] \
  [get_bd_pins xlconcat_interrupt_1/In2] [get_bd_pins xlconcat_interrupt_1/In3] [get_bd_pins xlconcat_interrupt_1/In4] \
  [get_bd_pins xlconcat_interrupt_1/In5] [get_bd_pins xlconcat_interrupt_1/In6] [get_bd_pins xlconcat_interrupt_1/In7] \
  [get_bd_pins xlconcat_interrupt_1/In8] [get_bd_pins xlconcat_interrupt_1/In9] [get_bd_pins xlconcat_interrupt_1/In10] \
  [get_bd_pins xlconcat_interrupt_1/In11] [get_bd_pins xlconcat_interrupt_1/In12] [get_bd_pins xlconcat_interrupt_1/In13] \
  [get_bd_pins xlconcat_interrupt_1/In14] [get_bd_pins xlconcat_interrupt_1/In15] [get_bd_pins xlconcat_interrupt_1/In16] \
  [get_bd_pins xlconcat_interrupt_1/In17] [get_bd_pins xlconcat_interrupt_1/In18] [get_bd_pins xlconcat_interrupt_1/In19] \
  [get_bd_pins xlconcat_interrupt_1/In20] [get_bd_pins xlconcat_interrupt_1/In21] [get_bd_pins xlconcat_interrupt_1/In22] \
  [get_bd_pins xlconcat_interrupt_1/In23] [get_bd_pins xlconcat_interrupt_1/In24] [get_bd_pins xlconcat_interrupt_1/In25] \
  [get_bd_pins xlconcat_interrupt_1/In26] [get_bd_pins xlconcat_interrupt_1/In27] [get_bd_pins xlconcat_interrupt_1/In28] \
  [get_bd_pins xlconcat_interrupt_1/In29] [get_bd_pins xlconcat_interrupt_1/In30] [get_bd_pins xlconcat_interrupt_1/In31] \
  [get_bd_pins xlconcat_interrupt_2/In0] [get_bd_pins xlconcat_interrupt_2/In1] [get_bd_pins xlconcat_interrupt_2/In2] \
  [get_bd_pins xlconcat_interrupt_2/In3] [get_bd_pins xlconcat_interrupt_2/In4] [get_bd_pins xlconcat_interrupt_2/In5] \
  [get_bd_pins xlconcat_interrupt_2/In6] [get_bd_pins xlconcat_interrupt_2/In7] [get_bd_pins xlconcat_interrupt_2/In8] \
  [get_bd_pins xlconcat_interrupt_2/In9] [get_bd_pins xlconcat_interrupt_2/In10] [get_bd_pins xlconcat_interrupt_2/In11] \
  [get_bd_pins xlconcat_interrupt_2/In12] [get_bd_pins xlconcat_interrupt_2/In13] [get_bd_pins xlconcat_interrupt_2/In14] \
  [get_bd_pins xlconcat_interrupt_2/In15] [get_bd_pins xlconcat_interrupt_2/In16] [get_bd_pins xlconcat_interrupt_2/In17] \
  [get_bd_pins xlconcat_interrupt_2/In18] [get_bd_pins xlconcat_interrupt_2/In19] [get_bd_pins xlconcat_interrupt_2/In20] \
  [get_bd_pins xlconcat_interrupt_2/In21] [get_bd_pins xlconcat_interrupt_2/In22] [get_bd_pins xlconcat_interrupt_2/In23] \
  [get_bd_pins xlconcat_interrupt_2/In24] [get_bd_pins xlconcat_interrupt_2/In25] [get_bd_pins xlconcat_interrupt_2/In26] \
  [get_bd_pins xlconcat_interrupt_2/In27] [get_bd_pins xlconcat_interrupt_2/In28] [get_bd_pins xlconcat_interrupt_2/In29] \
  [get_bd_pins xlconcat_interrupt_2/In30] [get_bd_pins xlconcat_interrupt_2/In31] [get_bd_pins xlconcat_interrupt_3/In0] \
  [get_bd_pins xlconcat_interrupt_3/In1] [get_bd_pins xlconcat_interrupt_3/In2] [get_bd_pins xlconcat_interrupt_3/In3] \
  [get_bd_pins xlconcat_interrupt_3/In4] [get_bd_pins xlconcat_interrupt_3/In5] [get_bd_pins xlconcat_interrupt_3/In6] \
  [get_bd_pins xlconcat_interrupt_3/In7] [get_bd_pins xlconcat_interrupt_3/In8] [get_bd_pins xlconcat_interrupt_3/In9] \
  [get_bd_pins xlconcat_interrupt_3/In10] [get_bd_pins xlconcat_interrupt_3/In11] [get_bd_pins xlconcat_interrupt_3/In12] \
  [get_bd_pins xlconcat_interrupt_3/In13] [get_bd_pins xlconcat_interrupt_3/In14] [get_bd_pins xlconcat_interrupt_3/In15] \
  [get_bd_pins xlconcat_interrupt_3/In16] [get_bd_pins xlconcat_interrupt_3/In17] [get_bd_pins xlconcat_interrupt_3/In18] \
  [get_bd_pins xlconcat_interrupt_3/In19] [get_bd_pins xlconcat_interrupt_3/In20] [get_bd_pins xlconcat_interrupt_3/In21] \
  [get_bd_pins xlconcat_interrupt_3/In22] [get_bd_pins xlconcat_interrupt_3/In23] [get_bd_pins xlconcat_interrupt_3/In24] \
  [get_bd_pins xlconcat_interrupt_3/In25] [get_bd_pins xlconcat_interrupt_3/In26] [get_bd_pins xlconcat_interrupt_3/In27] \
  [get_bd_pins xlconcat_interrupt_3/In28] [get_bd_pins xlconcat_interrupt_3/In29] [get_bd_pins xlconcat_interrupt_3/In30] \
  [get_bd_pins xlconcat_interrupt_3/In31]
connect_bd_net -net In0_1 [get_bd_pins In0] [get_bd_pins xlconcat_interrupt_0/In0]

current_bd_instance /slr0
connect_bd_intf_net [get_bd_intf_pins M01_AXI] [get_bd_intf_pins interconnect_axilite_user/M01_AXI]
connect_bd_intf_net [get_bd_intf_pins regslice_control_userpf_M_AXI_slr0] [get_bd_intf_pins axi_vip_ctrl_userpf/S_AXI]
connect_bd_intf_net [get_bd_intf_pins axi_cdc_data/S_AXI] [get_bd_intf_pins regslice_data/M_AXI]
connect_bd_intf_net [get_bd_intf_pins regslice_data_M_AXI_slr0] [get_bd_intf_pins axi_vip_data/S_AXI]
connect_bd_intf_net [get_bd_intf_pins axi_vip_data/M_AXI] [get_bd_intf_pins regslice_data/S_AXI]
connect_bd_intf_net [get_bd_intf_pins axi_vip_ctrl_userpf/M_AXI] [get_bd_intf_pins regslice_control_userpf/S_AXI]
connect_bd_intf_net [get_bd_intf_pins axi_cdc_data_M_AXI] [get_bd_intf_pins axi_cdc_data/M_AXI]
connect_bd_intf_net [get_bd_intf_pins axi_gpio_null/S_AXI] [get_bd_intf_pins interconnect_axilite_user/M00_AXI]
connect_bd_intf_net [get_bd_intf_pins interconnect_axilite_user/S00_AXI] [get_bd_intf_pins regslice_control_userpf/M_AXI]
connect_bd_net -net ARESETN_1 [get_bd_pins reset_controllers/psreset_gate_pr_control_interconnect_aresetn] \
  [get_bd_pins interconnect_axilite_user/ARESETN] [get_bd_pins interconnect_axilite_user/S00_ARESETN] \
  [get_bd_pins interconnect_axilite_user/M00_ARESETN] [get_bd_pins axi_gpio_null/s_axi_aresetn] \
  [get_bd_pins axi_vip_ctrl_userpf/aresetn] [get_bd_pins regslice_control_userpf/aresetn]
connect_bd_net -net clkwiz_kernel2_clk_out1_1 [get_bd_pins clkwiz_kernel2_clk_out1] [get_bd_pins reset_controllers/clkwiz_kernel2_clk_out1]
connect_bd_net -net clkwiz_kernel2_locked_1 [get_bd_pins clkwiz_kernel2_locked_slr0] [get_bd_pins reset_controllers/clkwiz_kernel2_locked_slr0]
connect_bd_net -net clkwiz_kernel_clk_out1_1 [get_bd_pins clkwiz_kernel_clk_out1] \
  [get_bd_pins reset_controllers/clkwiz_kernel_clk_out1] [get_bd_pins axi_cdc_data/m_axi_aclk] \
  [get_bd_pins interconnect_axilite_user/M01_ACLK]
connect_bd_net -net clkwiz_kernel_locked_1 [get_bd_pins clkwiz_kernel_locked_slr0] [get_bd_pins reset_controllers/clkwiz_kernel_locked_slr0]
connect_bd_net -net clkwiz_sysclks_locked_1 [get_bd_pins clkwiz_sysclks_locked_slr0] [get_bd_pins reset_controllers/clkwiz_sysclks_locked_slr0]
connect_bd_net [get_bd_pins dma_pcie_axi_aclk] \
  [get_bd_pins reset_controllers/dma_pcie_axi_aclk] [get_bd_pins axi_cdc_data/s_axi_aclk] [get_bd_pins axi_vip_data/aclk] \
  [get_bd_pins regslice_data/aclk]
connect_bd_net -net pcie_user_lnk_up_1 [get_bd_pins pcie_user_lnk_up_slr0] [get_bd_pins reset_controllers/pcie_user_lnk_up_slr0]
connect_bd_net -net reset_controllers_interconnect_aresetn [get_bd_pins reset_controllers/psreset_gate_pr_data_interconnect_aresetn] \
  [get_bd_pins axi_cdc_data/s_axi_aresetn] [get_bd_pins axi_vip_data/aresetn] [get_bd_pins regslice_data/aresetn]
connect_bd_net -net reset_controllers_interconnect_aresetn1 [get_bd_pins reset_controllers/psreset_gate_pr_kernel_interconnect_aresetn] \
  [get_bd_pins axi_cdc_data/m_axi_aresetn] [get_bd_pins interconnect_axilite_user/M01_ARESETN]
connect_bd_net -net slice_reset_kernel_pr_Dout_1 [get_bd_pins slice_reset_kernel_pr_Dout_slr0] \
  [get_bd_pins reset_controllers/slice_reset_kernel_pr_Dout_slr0]
connect_bd_net -net slowest_sync_clk_1 [get_bd_pins clkwiz_sysclks_clk_out2] \
  [get_bd_pins reset_controllers/clkwiz_sysclks_clk_out2] [get_bd_pins interconnect_axilite_user/ACLK] \
  [get_bd_pins interconnect_axilite_user/S00_ACLK] [get_bd_pins interconnect_axilite_user/M00_ACLK] \
  [get_bd_pins axi_gpio_null/s_axi_aclk] [get_bd_pins axi_vip_ctrl_userpf/aclk] [get_bd_pins regslice_control_userpf/aclk]
connect_bd_net [get_bd_pins reset_controllers/peripheral_aresetn] [get_bd_pins peripheral_aresetn]
set_property PFM.AXI_PORT {M01_AXI {memport "M_AXI_GP"} M02_AXI {memport "M_AXI_GP"} M03_AXI {memport "M_AXI_GP"} M04_AXI {memport "M_AXI_GP"} M05_AXI {memport "M_AXI_GP"} M06_AXI {memport "M_AXI_GP"} M07_AXI {memport "M_AXI_GP"} M08_AXI {memport "M_AXI_GP"} M09_AXI {memport "M_AXI_GP"} M10_AXI {memport "M_AXI_GP"} M11_AXI {memport "M_AXI_GP"} M12_AXI {memport "M_AXI_GP"} M13_AXI {memport "M_AXI_GP"} M14_AXI {memport "M_AXI_GP"} M15_AXI {memport "M_AXI_GP"} M16_AXI {memport "M_AXI_GP"} M17_AXI {memport "M_AXI_GP"} M18_AXI {memport "M_AXI_GP"} M19_AXI {memport "M_AXI_GP"} M20_AXI {memport "M_AXI_GP"} M21_AXI {memport "M_AXI_GP"} M22_AXI {memport "M_AXI_GP"} M23_AXI {memport "M_AXI_GP"} M24_AXI {memport "M_AXI_GP"} M25_AXI {memport "M_AXI_GP"} M26_AXI {memport "M_AXI_GP"} M27_AXI {memport "M_AXI_GP"} M28_AXI {memport "M_AXI_GP"} M29_AXI {memport "M_AXI_GP"} M30_AXI {memport "M_AXI_GP"}} [get_bd_cells interconnect_axilite_user]

current_bd_instance /slr0/reset_controllers
connect_bd_net -net clkwiz_kernel2_locked_slr0_1 [get_bd_pins clkwiz_kernel2_locked_slr0] [get_bd_pins psreset_gate_pr_kernel2/aux_reset_in]
connect_bd_net [get_bd_pins clkwiz_kernel_clk_out1] [get_bd_pins psreset_gate_pr_kernel/slowest_sync_clk]
connect_bd_net -net clkwiz_kernel_locked_slr0_1 [get_bd_pins clkwiz_kernel_locked_slr0] [get_bd_pins psreset_gate_pr_kernel/aux_reset_in]
connect_bd_net -net clkwiz_sysclks_locked_slr0_1 [get_bd_pins clkwiz_sysclks_locked_slr0] [get_bd_pins psreset_gate_pr_control/aux_reset_in]
connect_bd_net [get_bd_pins dma_pcie_axi_aclk] [get_bd_pins psreset_gate_pr_data/slowest_sync_clk]
connect_bd_net -net ext_reset_in_1 [get_bd_pins slice_reset_kernel_pr_Dout_slr0] \
  [get_bd_pins psreset_gate_pr_control/ext_reset_in] [get_bd_pins psreset_gate_pr_data/ext_reset_in] \
  [get_bd_pins psreset_gate_pr_kernel/ext_reset_in] [get_bd_pins psreset_gate_pr_kernel2/ext_reset_in]
connect_bd_net -net pcie_user_lnk_up_slr0_1 [get_bd_pins pcie_user_lnk_up_slr0] [get_bd_pins psreset_gate_pr_data/aux_reset_in]
connect_bd_net [get_bd_pins psreset_gate_pr_control/interconnect_aresetn] [get_bd_pins psreset_gate_pr_control_interconnect_aresetn]
connect_bd_net [get_bd_pins psreset_gate_pr_data/interconnect_aresetn] [get_bd_pins psreset_gate_pr_data_interconnect_aresetn]
connect_bd_net [get_bd_pins psreset_gate_pr_kernel/interconnect_aresetn] [get_bd_pins psreset_gate_pr_kernel_interconnect_aresetn]
connect_bd_net -net slowest_sync_clk_1 [get_bd_pins clkwiz_sysclks_clk_out2] [get_bd_pins psreset_gate_pr_control/slowest_sync_clk]
connect_bd_net -net slowest_sync_clk_4 [get_bd_pins clkwiz_kernel2_clk_out1] [get_bd_pins psreset_gate_pr_kernel2/slowest_sync_clk]
connect_bd_net [get_bd_pins psreset_gate_pr_kernel/peripheral_aresetn] [get_bd_pins peripheral_aresetn]

current_bd_instance /slr1
connect_bd_intf_net [get_bd_intf_pins axi_cdc_data_dynamic/S_AXI] [get_bd_intf_pins regslice_data_dynamic/M_AXI]
connect_bd_intf_net [get_bd_intf_pins axi_vip_data_m00_axi/S_AXI] [get_bd_intf_pins regslice_data_m00_axi/M_AXI]
connect_bd_intf_net [get_bd_intf_pins regslice_data_dynamic_M_AXI_slr1] [get_bd_intf_pins axi_vip_data_dynamic/S_AXI]
connect_bd_intf_net [get_bd_intf_pins axi_vip_data_dynamic/M_AXI] [get_bd_intf_pins regslice_data_dynamic/S_AXI]
connect_bd_intf_net [get_bd_intf_pins interconnect_axilite_user/S00_AXI] [get_bd_intf_pins regslice_control_userpf/M_AXI]
connect_bd_intf_net [get_bd_intf_pins regslice_control_periph_M_AXI_slr1] [get_bd_intf_pins freq_counter_0/axil]
connect_bd_intf_net [get_bd_intf_pins regslice_data_static_M_AXI_slr1] [get_bd_intf_pins axi_vip_data_static/S_AXI]
connect_bd_intf_net [get_bd_intf_pins regslice_control_userpf_M_AXI_slr1] [get_bd_intf_pins axi_vip_ctrl_userpf/S_AXI]
connect_bd_intf_net [get_bd_intf_pins axi_vip_data_static/M_AXI] [get_bd_intf_pins regslice_data_static/S_AXI]
connect_bd_intf_net [get_bd_intf_pins axi_vip_ctrl_mgntpf_M_AXI] [get_bd_intf_pins regslice_control_mgntpf/M_AXI]
connect_bd_intf_net [get_bd_intf_pins memory_subsystem_M00_AXI] [get_bd_intf_pins regslice_data_m00_axi/S_AXI]
connect_bd_intf_net [get_bd_intf_pins axi_cdc_data_static/S_AXI] [get_bd_intf_pins regslice_data_static/M_AXI]
connect_bd_intf_net [get_bd_intf_pins axi_vip_data_m00_axi] [get_bd_intf_pins axi_vip_data_m00_axi/M_AXI]
connect_bd_intf_net [get_bd_intf_pins M00_AXI] [get_bd_intf_pins interconnect_axilite_user/M00_AXI]
connect_bd_intf_net [get_bd_intf_pins axi_vip_ctrl_mgntpf/M_AXI] [get_bd_intf_pins regslice_control_mgntpf/S_AXI]
connect_bd_intf_net [get_bd_intf_pins regslice_control_M_AXI_slr1] [get_bd_intf_pins axi_vip_ctrl_mgntpf/S_AXI]
connect_bd_intf_net [get_bd_intf_pins axi_vip_ctrl_userpf/M_AXI] [get_bd_intf_pins regslice_control_userpf/S_AXI]
connect_bd_intf_net [get_bd_intf_pins axi_cdc_data_dynamic_M_AXI] [get_bd_intf_pins axi_cdc_data_dynamic/M_AXI]
connect_bd_intf_net [get_bd_intf_pins axi_cdc_data_static_M_AXI] [get_bd_intf_pins axi_cdc_data_static/M_AXI]
connect_bd_net -net ARESETN_1 [get_bd_pins reset_controllers/psreset_gate_pr_control_interconnect_aresetn] \
  [get_bd_pins freq_counter_0/reset_n] [get_bd_pins interconnect_axilite_user/ARESETN] \
  [get_bd_pins interconnect_axilite_user/S00_ARESETN] [get_bd_pins interconnect_axilite_user/M00_ARESETN] \
  [get_bd_pins axi_vip_ctrl_mgntpf/aresetn] [get_bd_pins axi_vip_ctrl_userpf/aresetn] \
  [get_bd_pins regslice_control_mgntpf/aresetn] [get_bd_pins regslice_control_userpf/aresetn] \
  [get_bd_pins psreset_gate_pr_control_interconnect_aresetn]
connect_bd_net -net aclk_0_1 [get_bd_pins dma_pcie_axi_aclk] \
  [get_bd_pins reset_controllers/dma_pcie_axi_aclk] [get_bd_pins axi_cdc_data_dynamic/s_axi_aclk] \
  [get_bd_pins axi_cdc_data_static/s_axi_aclk] [get_bd_pins axi_vip_data_dynamic/aclk] [get_bd_pins axi_vip_data_static/aclk] \
  [get_bd_pins regslice_data_dynamic/aclk] [get_bd_pins regslice_data_static/aclk]
connect_bd_net -net clkwiz_kernel2_clk_out1_1 [get_bd_pins clkwiz_kernel2_clk_out1] \
  [get_bd_pins freq_counter_0/test_clk1] [get_bd_pins reset_controllers/clkwiz_kernel2_clk_out1]
connect_bd_net -net clkwiz_kernel2_locked_1 [get_bd_pins clkwiz_kernel2_locked_slr1] [get_bd_pins reset_controllers/clkwiz_kernel2_locked_slr1]
connect_bd_net -net clkwiz_kernel_clk_out1_1 [get_bd_pins clkwiz_kernel_clk_out1] \
  [get_bd_pins freq_counter_0/test_clk0] [get_bd_pins reset_controllers/clkwiz_kernel_clk_out1] \
  [get_bd_pins axi_cdc_data_dynamic/m_axi_aclk] [get_bd_pins axi_cdc_data_static/m_axi_aclk]
connect_bd_net -net clkwiz_kernel_locked_1 [get_bd_pins clkwiz_kernel_locked_slr1] [get_bd_pins reset_controllers/clkwiz_kernel_locked_slr1]
connect_bd_net -net clkwiz_sysclks_locked_1 [get_bd_pins clkwiz_sysclks_locked_slr1] [get_bd_pins reset_controllers/clkwiz_sysclks_locked_slr1]
connect_bd_net -net dcm_locked_0_1 [get_bd_pins pcie_user_lnk_up_slr1] [get_bd_pins reset_controllers/pcie_user_lnk_up_slr1]
connect_bd_net -net dcm_locked_0_2 [get_bd_pins ddrmem_1_c0_init_calib_complete] [get_bd_pins reset_controllers/ddrmem_1_c0_init_calib_complete]
connect_bd_net [get_bd_pins iob_static_perst_n_out] [get_bd_pins reset_controllers/iob_static_perst_n_out]
connect_bd_net -net m_axi_aclk_0_1 [get_bd_pins ddrmem_1_c0_ddr4_ui_clk] \
  [get_bd_pins reset_controllers/ddrmem_1_c0_ddr4_ui_clk] [get_bd_pins axi_vip_data_m00_axi/aclk] \
  [get_bd_pins regslice_data_m00_axi/aclk]
connect_bd_net -net reset_controllers_interconnect_aresetn [get_bd_pins reset_controllers/psreset_gate_pr_data_interconnect_aresetn] \
  [get_bd_pins psreset_gate_pr_data_interconnect_aresetn] [get_bd_pins axi_cdc_data_dynamic/s_axi_aresetn] \
  [get_bd_pins axi_cdc_data_static/s_axi_aresetn] [get_bd_pins axi_vip_data_dynamic/aresetn] \
  [get_bd_pins axi_vip_data_static/aresetn] [get_bd_pins regslice_data_dynamic/aresetn] \
  [get_bd_pins regslice_data_static/aresetn]
connect_bd_net -net reset_controllers_interconnect_aresetn1 [get_bd_pins reset_controllers/psreset_gate_pr_ddrmem_1_interconnect_aresetn] \
  [get_bd_pins axi_vip_data_m00_axi/aresetn] [get_bd_pins regslice_data_m00_axi/aresetn]
connect_bd_net [get_bd_pins reset_controllers/logic_reset_op_Res] [get_bd_pins logic_reset_op_Res]
connect_bd_net [get_bd_pins reset_controllers/psreset_gate_pr_kernel_interconnect_aresetn] \
  [get_bd_pins psreset_gate_pr_kernel_interconnect_aresetn] [get_bd_pins axi_cdc_data_dynamic/m_axi_aresetn] \
  [get_bd_pins axi_cdc_data_static/m_axi_aresetn]
connect_bd_net -net slice_reset_kernel_pr_Dout_1 [get_bd_pins slice_reset_kernel_pr_Dout_slr1] \
  [get_bd_pins reset_controllers/slice_reset_kernel_pr_Dout_slr1]
connect_bd_net -net slowest_sync_clk_1 [get_bd_pins clkwiz_sysclks_clk_out2] \
  [get_bd_pins freq_counter_0/clk] [get_bd_pins reset_controllers/clkwiz_sysclks_clk_out2] \
  [get_bd_pins interconnect_axilite_user/ACLK] [get_bd_pins interconnect_axilite_user/S00_ACLK] \
  [get_bd_pins interconnect_axilite_user/M00_ACLK] [get_bd_pins axi_vip_ctrl_mgntpf/aclk] \
  [get_bd_pins axi_vip_ctrl_userpf/aclk] [get_bd_pins regslice_control_mgntpf/aclk] \
  [get_bd_pins regslice_control_userpf/aclk]
set_property PFM.AXI_PORT {M01_AXI {memport "M_AXI_GP"} M02_AXI {memport "M_AXI_GP"} M03_AXI {memport "M_AXI_GP"} M04_AXI {memport "M_AXI_GP"} M05_AXI {memport "M_AXI_GP"} M06_AXI {memport "M_AXI_GP"} M07_AXI {memport "M_AXI_GP"} M08_AXI {memport "M_AXI_GP"} M09_AXI {memport "M_AXI_GP"} M10_AXI {memport "M_AXI_GP"} M11_AXI {memport "M_AXI_GP"} M12_AXI {memport "M_AXI_GP"} M13_AXI {memport "M_AXI_GP"} M14_AXI {memport "M_AXI_GP"} M15_AXI {memport "M_AXI_GP"} M16_AXI {memport "M_AXI_GP"} M17_AXI {memport "M_AXI_GP"} M18_AXI {memport "M_AXI_GP"} M19_AXI {memport "M_AXI_GP"} M20_AXI {memport "M_AXI_GP"} M21_AXI {memport "M_AXI_GP"} M22_AXI {memport "M_AXI_GP"} M23_AXI {memport "M_AXI_GP"} M24_AXI {memport "M_AXI_GP"} M25_AXI {memport "M_AXI_GP"} M26_AXI {memport "M_AXI_GP"} M27_AXI {memport "M_AXI_GP"} M28_AXI {memport "M_AXI_GP"} M29_AXI {memport "M_AXI_GP"} M30_AXI {memport "M_AXI_GP"} M31_AXI {memport "M_AXI_GP"} M32_AXI {memport "M_AXI_GP"} M33_AXI {memport "M_AXI_GP"} M34_AXI {memport "M_AXI_GP"} M35_AXI {memport "M_AXI_GP"} M36_AXI {memport "M_AXI_GP"} M37_AXI {memport "M_AXI_GP"} M38_AXI {memport "M_AXI_GP"} M39_AXI {memport "M_AXI_GP"} M40_AXI {memport "M_AXI_GP"} M41_AXI {memport "M_AXI_GP"} M42_AXI {memport "M_AXI_GP"} M43_AXI {memport "M_AXI_GP"} M44_AXI {memport "M_AXI_GP"} M45_AXI {memport "M_AXI_GP"} M46_AXI {memport "M_AXI_GP"} M47_AXI {memport "M_AXI_GP"} M48_AXI {memport "M_AXI_GP"} M49_AXI {memport "M_AXI_GP"} M50_AXI {memport "M_AXI_GP"} M51_AXI {memport "M_AXI_GP"} M52_AXI {memport "M_AXI_GP"} M53_AXI {memport "M_AXI_GP"} M54_AXI {memport "M_AXI_GP"} M55_AXI {memport "M_AXI_GP"} M56_AXI {memport "M_AXI_GP"} M57_AXI {memport "M_AXI_GP"} M58_AXI {memport "M_AXI_GP"} M59_AXI {memport "M_AXI_GP"} M60_AXI {memport "M_AXI_GP"} M61_AXI {memport "M_AXI_GP"} M62_AXI {memport "M_AXI_GP"}} [get_bd_cells interconnect_axilite_user]
